# Altium project Udemy_ADAK.PrjPcb (part 3 of 3)

## Sheet Sensor Board.SchDoc
size A3; SheetNumber: 4; SheetTotal: 4
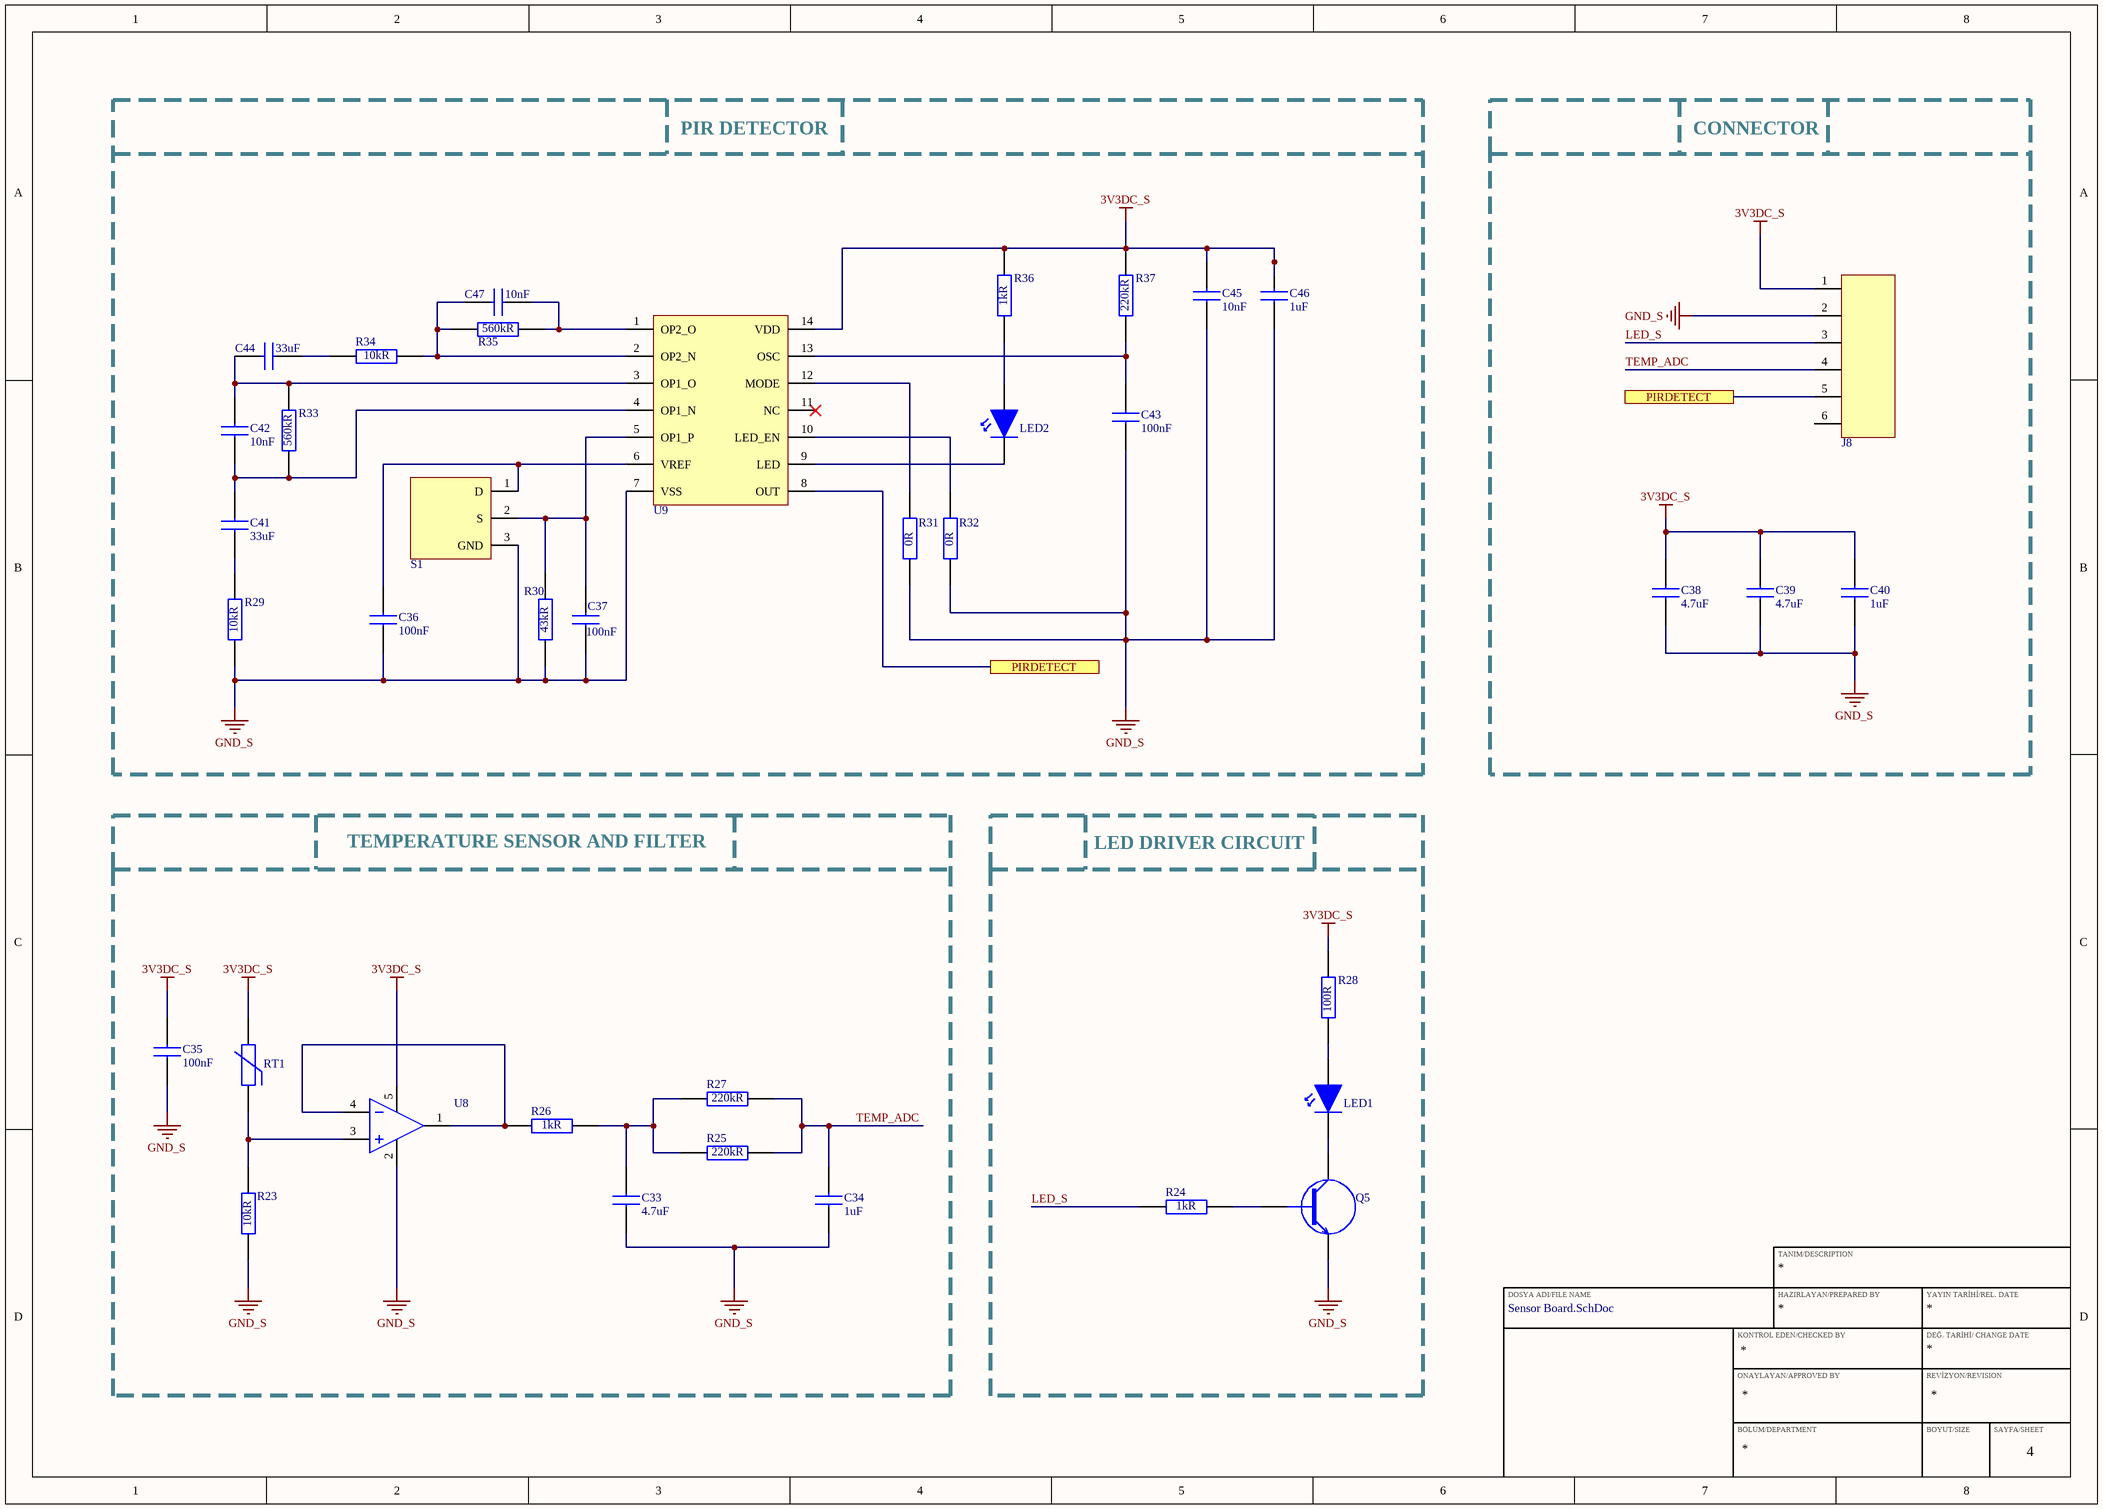
[diagram p3: Sensor Board.SchDoc]

### Parts
C33  Capacitance: 4.7uF  [CAP_0805]  (hidden comment: CL21A475KAQNNNE)
C34  Capacitance: 1uF  [CAP_0805]  (hidden comment: CL21B105KBFNNNE)
C35  Capacitance: 100nF  [CAP_0603]  (hidden comment: C0603C104K4RAC7867)
C36  Capacitance: 100nF  [CAP_0805]  (hidden comment: CL21B104KBCNNNC)
C37  Capacitance: 100nF  [CAP_0805]  (hidden comment: CL21B104KBCNNNC)
C38  Capacitance: 4.7uF  [CAP_0805]  (hidden comment: CL21A475KAQNNNE)
C39  Capacitance: 4.7uF  [CAP_0805]  (hidden comment: CL21A475KAQNNNE)
C40  Capacitance: 1uF  [CAP_0805]  (hidden comment: CL21B105KBFNNNE)
C41  Capacitance: 33uF  [CAP_0805]  (hidden comment: C2012X5R1A336M125AC)
C42  Capacitance: 10nF  [CAP_0603]  (hidden comment: 0603B103K160CT)
C43  Capacitance: 100nF  [CAP_0805]  (hidden comment: CL21B104KBCNNNC)
C44  Capacitance: 33uF  [CAP_0805]  (hidden comment: C2012X5R1A336M125AC)
C45  Capacitance: 10nF  [CAP_0603]  (hidden comment: 0603B103K160CT)
C46  Capacitance: 1uF  [CAP_0805]  (hidden comment: CL21B105KBFNNNE)
C47  Capacitance: 10nF  [CAP_0603]  (hidden comment: 0603B103K160CT)
J8  64800611622  [64800611622]  (value not drawn)
LED1  150080SS75000  [LED_RED_0805]  (value not drawn)
LED2  150080GS75000  [LED_GREEN_0805]  (value not drawn)
Q5  MMBT3904-7-F  [SOT-23F]  (value not drawn)
R23  Resistance: 10kR  [RES_0603]  (hidden comment: RC0603FR-0710KL)
R24  Resistance: 1kR  [RES_0603]  (hidden comment: RC0603FR-071KL)
R25  Resistance: 220kR  [RES_0603]  (hidden comment: RC0603JR-07220KL)
R26  Resistance: 1kR  [RES_0603]  (hidden comment: RC0603FR-071KL)
R27  Resistance: 220kR  [RES_0603]  (hidden comment: RC0603JR-07220KL)
R28  Resistance: 100R  [RES_0603]  (hidden comment: RC0603JR-13100RL)
R29  Resistance: 10kR  [RES_0603]  (hidden comment: RC0603FR-0710KL)
R30  Resistance: 43kR  [RES_0603]  (hidden comment: RC0603FR-0743KL)
R31  Resistance: 0R  [RES_0603]  (hidden comment: RC0603JR-070RL)
R32  Resistance: 0R  [RES_0603]  (hidden comment: RC0603JR-070RL)
R33  Resistance: 560kR  [RES_0603]  (hidden comment: RC0603JR-07560KL)
R34  Resistance: 10kR  [RES_0603]  (hidden comment: RC0603FR-0710KL)
R35  Resistance: 560kR  [RES_0603]  (hidden comment: RC0603JR-07560KL)
R36  Resistance: 1kR  [RES_0603]  (hidden comment: RC0603FR-071KL)
R37  Resistance: 220kR  [RES_0603]  (hidden comment: RC0603JR-07220KL)
RT1  TFPT1206L1002FM  [RES_1206]  (value not drawn)
S1  LHI 878/3902  [LHI 878]  (value not drawn)
U8  OPA314AIDBVT  [SOT23-5]  (value not drawn)
U9  NCS36000DRG  [SOIC-14]  (value not drawn)

### Blocks framed on the sheet
PIR DETECTOR: C36 C37 C41-C47 LED2 R29-R37 S1 U9
CONNECTOR: C38-C40 J8
TEMPERATURE SENSOR AND FILTER: C33-C35 R23 R25-R27 RT1 U8
LED DRIVER CIRCUIT: LED1 Q5 R24 R28

### Ports
PIRDETECT

### Nets
3V3DC_S: C35.2 C38.2 C39.2 C40.2 C45.2 C46.2 J8.1 R28.2 R36.2 R37.2 RT1.2 U8.5 U9.14(VDD)
GND_S: C33.1 C34.1 C35.1 C36.1 C37.2 C38.1 C39.1 C40.1 C43.2 C45.1 C46.1 J8.2 Q5.2(E) R23.1 R29.2 R30.1 R31.1 R32.1 S1.3(GND) U8.2 U9.7(VSS)
LED_S: J8.3 R24.1
TEMP_ADC: C34.2 J8.4 R25.2 R27.2
NetC33_2: C33.2 R25.1 R26.2 R27.1
NetC36_2: C36.2 S1.1(D) U9.6(VREF)
NetC37_1: C37.1 R30.2 S1.2(S) U9.5(OP1_P)
NetC41_1: C41.1 C42.2 R33.2 U9.4(OP1_N)
NetC41_2: C41.2 R29.1
NetC42_1: C42.1 C44.1 R33.1 U9.3(OP1_O)
NetC43_1: C43.1 R37.1 U9.13(OSC)
NetC44_2: C44.2 R34.1
NetC47_1: C47.1 R34.2 R35.1 U9.2(OP2_N)
NetC47_2: C47.2 R35.2 U9.1(OP2_O)
NetJ8_5: J8.5 U9.8(OUT) ; port PIRDETECT
NetLED1_1: LED1.1 Q5.3(C)
NetLED1_2: LED1.2 R28.1
NetLED2_1: LED2.1 U9.9(LED)
NetLED2_2: LED2.2 R36.1
NetQ5_1: Q5.1(B) R24.2
NetR23_2: R23.2 RT1.1 U8.3
NetR26_1: R26.1 U8.1 U8.4
NetR31_2: R31.2 U9.12(MODE)
NetR32_2: R32.2 U9.10(LED_EN)

Not connected (* = marked no-connect by the designer): J8 6; U9 11(NC)*

### Notes on the sheet
- TANIM/DESCRIPTION
- DOSYA ADI/FILE NAME
- HAZIRLAYAN/PREPARED BY
- YAYIN TARİHİ/REL. DATE
- KONTROL EDEN/CHECKED BY
- ONAYLAYAN/APPROVED BY
- DEĞ. TARİHİ/ CHANGE DATE
- REVİZYON/REVISION
- BÖLÜM/DEPARTMENT
- BOYUT/SIZE
- SAYFA/SHEET

### Library data of the parts
C33 C38 C39 = CAP CER 4.7uF 0805: |CAP CER 4.7UF %10 0805 SMD X5R; Manufacturer: Samsung; Designed by: ADAK; Tolerance: 10%; Voltage Rating: 25V; Supplier 1: Digi-Key; Manufacturer Part Number: CL21A475KAQNNNE; RoHS: Yes; Category: Ceramic Capacitors; Stock 1: 4312449; Pricing 1: 1=0,10000, 10=0,07300, 50=0,04140, 100=0,03440, 500=0,02408, 1000=0,01994 (USD); Mount: Surface Mount; Case/Package: 0805; Case Code (Metric): 2012; Case Code (Imperial): 0805; Min Operating Temperature: -55°C; Max Operating Temperature: 85°C; Package Quantity: 1; Packaging: Tape and Reel; Dielectric: X5R; Voltage Rating (DC): 25V; Series: CL; Construction: Flat; Length: 2mm; Width: 0.049inch; Height: 1.25mm; Thickness: 0.055inch; Depth: 1.25mm; Radiation Hardening: No; Lead Free: Lead Free; RoHS Compliant: Yes; ComponentLink1URL: https://datasheet.ciiva.com/25798/cl21a475kaqnnne-25798882.pdf?src-supplier=Digi-Key; ComponentLink1Description: https://datasheet.ciiva.com/25798/cl21a475kaqnnne-25798882.pdf?src-supplier=Digi-Key; Supplier Part Number 1: 1276-1244-1-ND
C34 C40 C46 = CAP CER 1uF 0805: |CAP CER 1UF %10 0805 SMD X7R; Manufacturer: Samsung; Tolerance: 10%; Voltage Rating: 50V; Designed by: ADAK; Supplier 1: Digi-Key; Manufacturer Part Number: CL21B105KBFNNNE; RoHS: Yes; Category: Ceramic Capacitors; Stock 1: 1344581; Pricing 1: 1=0,11000, 10=0,07900, 50=0,04500, 100=0,03730, 500=0,02616, 1000=0,02165 (USD); Mount: Surface Mount; Case/Package: 0805; Case Code (Metric): 2012; Case Code (Imperial): 0805; Min Operating Temperature: -55°C; Max Operating Temperature: 125°C; Packaging: Tape and Reel; Package Quantity: 1; Dielectric: X7R; Voltage: 50V; Series: CL; Construction: Flat; Length: 2mm; Width: 0.049inch; Height: 1.25mm; Thickness: 0.053inch; Depth: 1.25mm; Radiation Hardening: No; RoHS Compliant: Yes; ComponentLink1URL: https://datasheet.ciiva.com/25800/cl21b105kbfnnne-25800291.pdf?src-supplier=Digi-Key; ComponentLink1Description: https://datasheet.ciiva.com/25800/cl21b105kbfnnne-25800291.pdf?src-supplier=Digi-Key; Supplier Part Number 1: 1276-1029-6-ND
C35 = CAP CER 100nF 0603: |CAP CER 100nF (0.1UF) %10 0603 SMD; Manufacturer: KEMET; Manufacturer Part Number: C0603C104K4RACTU; Dielectric Material: Ceramic; Tolerance: 10%; Dielectric: X7R; Voltage Rating: 16V; Dissipation Factor: 3.5%; Designed by: ADAK; Supplier 1: Digi-Key; RoHS: Yes; Category: Ceramic Capacitors; Pricing 1: 1=0,10000, 10=0,07200, 50=0,03940, 100=0,03220, 500=0,02298, 1000=0,01805 (USD); Mount: Surface Mount,PCB; Case/Package: 0603; Number of Pins: 2; Case Code (Metric): 1608; Case Code (Imperial): 0603; Contact Plating: Tin,Matte; Weight: 7.1E-05oz; Min Operating Temperature: -55°C; Max Operating Temperature: 125°C; Package Quantity: 4000; Packaging: Tape and Reel; Voltage Rating (DC): 16V; Termination: SMD/SMT; Voltage: 16V; Series: SMD Comm X7R; Construction: Flat; Length: 1.6mm; Width: 0.8mm; Height: 0.8mm; Thickness: 0.034inch; Lead Pitch: 0.7mm; Depth: 0.8mm; Radiation Hardening: No; Reach SVHC Compliant: Yes; RoHS Compliant: Yes; ComponentLink1URL: https://datasheet.ciiva.com/22749/kem-c1002-x7r-smd-22749657.pdf?src-supplier=Element14; ComponentLink1Description: https://datasheet.ciiva.com/22749/kem-c1002-x7r-smd-22749657.pdf?src-supplier=Element14; ComponentLink2URL: https://datasheet.ciiva.com/14589/70095383-14589014.pdf?src-supplier=Allied+Electronics; ComponentLink2Description: https://datasheet.ciiva.com/14589/70095383-14589014.pdf?src-supplier=Allied+Electronics; ComponentLink3URL: https://datasheet.ciiva.com/5413/kem-c1002-x7r-smd-5413791.pdf?src-supplier=Mouser; ComponentLink3Description: https://datasheet.ciiva.com/5413/kem-c1002-x7r-smd-5413791.pdf?src-supplier=Mouser; ComponentLink4URL: https://datasheet.ciiva.com/18192/getdatasheetpartid-330584-18192695.pdf?src-supplier=Verical; ComponentLink4Description: https://datasheet.ciiva.com/18192/getdatasheetpartid-330584-18192695.pdf?src-supplier=Verical; Supplier Part Number 1: 399-C0603C104K4RAC7867DKR-ND
C36 C37 C43 = CAP CER 100nF 0805: |CAP CER 0.1UF (100nF) %10 0805 SMD X7R; Manufacturer: Samsung; Designed by: ADAK; Material: Ceramic; Tolerance: 10%; Voltage Rating: 50V; Supplier 1: Digi-Key; Manufacturer Part Number: CL21B104KBCNNNC; RoHS: Yes; Category: Ceramic Capacitors; Stock 1: 3413319; Pricing 1: 1=0,10000, 10=0,04400, 50=0,02400, 100=0,01960, 500=0,01404, 1000=0,01103 (USD); Mount: Surface Mount; Case/Package: 0805; Case Code (Metric): 2012; Case Code (Imperial): 0805; Contact Plating: Tin; Min Operating Temperature: -55°C; Max Operating Temperature: 125°C; Dielectric: X7R; Packaging: Tape and Reel; Voltage: 50V; Voltage Rating (DC): 50V; Series: CL; Construction: Flat; Length: 2mm; Width: 0.049inch; Height: 0.85mm; Depth: 1.25mm; Thickness: 0.037inch; Radiation Hardening: No; Lead Free: Lead Free; RoHS Compliant: Yes; ComponentLink1URL: https://datasheet.ciiva.com/25710/cl21b104kbcnnnc-25710182.pdf?src-supplier=Digi-Key; ComponentLink1Description: https://datasheet.ciiva.com/25710/cl21b104kbcnnnc-25710182.pdf?src-supplier=Digi-Key; ComponentLink2URL: https://datasheet.ciiva.com/29199/454152-da-01-en-vs-kondensator-0805-29199814.pdf?src-supplier=Conrad; ComponentLink2Description: https://datasheet.ciiva.com/29199/454152-da-01-en-vs-kondensator-0805-29199814.pdf?src-supplier=Conrad; Supplier Part Number 1: 1276-1003-1-ND
C41 C44 = CAP CER 33uF 0805: |CAP CER 33UF %20 0805 X5R 10V; Manufacturer: TDK; Dielectric Material: Ceramic; Tolerance: 20%; Designed by: ADAK; Supplier 1: Digi-Key; Manufacturer Part Number: C2012X5R1A336M125AC; RoHS: Yes; Category: Ceramic Capacitors; Stock 1: 479672; Pricing 1: 1=0,86000, 10=0,65600, 50=0,54540, 100=0,46960, 500=0,36360, 1000=0,31310 (USD); Mount: Surface Mount; Case/Package: 0805; Case Code (Metric): 2012; Case Code (Imperial): 0805; Weight: 0.000194oz; Min Operating Temperature: -55°C; Max Operating Temperature: 85°C; Voltage Rating: 10V; Packaging: Tape and Reel; Termination: SMD/SMT; Package Quantity: 1; Voltage Rating (DC): 10V; Dielectric: X5R; Resistor Type: Ceramic; Series: C; Length: 2mm; Width: 0.049inch; Height: 1.25mm; Thickness: 0.057inch; Depth: 1.25mm; Reach SVHC Compliant: Yes; Lead Free: Lead Free; RoHS Compliant: Yes; ComponentLink1URL: https://datasheet.ciiva.com/24216/c2012x5r1a336m125ac-264804-24216541.pdf?src-supplier=Mouser; ComponentLink1Description: https://datasheet.ciiva.com/24216/c2012x5r1a336m125ac-264804-24216541.pdf?src-supplier=Mouser; ComponentLink2URL: https://datasheet.ciiva.com/6259/tdkmlcccaprange-6259263.pdf?src-supplier=Digi-Key; ComponentLink2Description: https://datasheet.ciiva.com/6259/tdkmlcccaprange-6259263.pdf?src-supplier=Digi-Key; Supplier Part Number 1: 445-8238-1-ND
C42 C45 C47 = CAP CER 10nF 0603: |CAP CER 10nF %10 0603 SMD X7R; Manufacturer: Walsin Technologies; Tolerance: 10%; Voltage Rating: 16V; Designed by: ADAK; Supplier 1: Digi-Key; Manufacturer Part Number: 0603B103K160CT; RoHS: Yes; Category: Ceramic Capacitors; Stock 1: 148568; Pricing 1: 1=0,10000, 10=0,03300, 50=0,01820, 100=0,01480, 500=0,01060, 1000=0,00833 (USD); Case/Package: 0603; Case Code (Metric): 1608; Case Code (Imperial): 0603; Min Operating Temperature: -55°C; Max Operating Temperature: 125°C; Packaging: Tape and Reel; Dielectric: X7R; Voltage Rating (DC): 16V; Length: 1.6mm; Depth: 0.8mm; RoHS Compliant: Yes; ComponentLink1URL: http://www.farnell.com/datasheets/1958513.pdf?src-supplier=Farnell; ComponentLink1Description: http://www.farnell.com/datasheets/1958513.pdf?src-supplier=Farnell; ComponentLink2URL: http://www.farnell.com/datasheets/1958513.pdf?src-supplier=Element14; ComponentLink2Description: http://www.farnell.com/datasheets/1958513.pdf?src-supplier=Element14; ComponentLink3URL: http://www.passivecomponent.com/wp-content/uploads/2018/10/MLCC.pdf?src-supplier=Digi-Key; ComponentLink3Description: http://www.passivecomponent.com/wp-content/uploads/2018/10/MLCC.pdf?src-supplier=Digi-Key; Supplier Part Number 1: 1292-1384-1-ND
J8 = 64800611622_CONN_6P: |Connector (1.50mm) 6 Pin Header Through Hole; Manufacturer: Wurth Electronics; Designed by: ADAK; Supplier 1: Digi-Key; Manufacturer Part Number: 64800611622; RoHS: No; Stock 1: 979; Pricing 1: 1=0,42000, 50=0,40600, 100=0,38400, 250=0,36100, 500=0,33900 (USD); Supplier Part Number 1: 732-64800611622-ND
LED1 = LED RED 0805: |LED RED CLEAR 0805 SMD; Manufacturer: Wurth Electronics; Lens Color: Colorless; Luminous Intensity: 60mcd; Forward Current: 30mA; Forward Voltage: 1.9V; Viewing Angle: 140°; Wavelength: 630nm; Lens Style: Clear,Flat,Rectangular; Test Current: 20mA; Lens Size: 1.25mm; Designed by: ADAK; Supplier 1: Digi-Key; Manufacturer Part Number: 150080SS75000; RoHS: Yes; Category: LEDs; Stock 1: 36817; Pricing 1: 1=0,19000, 50=0,17600, 100=0,15100, 500=0,13100 (USD); Mount: Surface Mount; Case/Package: 0805; Color: Red; Case Code (Metric): 2012; Case Code (Imperial): 0805; Min Operating Temperature: -40°C; Max Operating Temperature: 85°C; Package Quantity: 1; Packaging: Cut Tape; Dominant Wavelength: 630nm; Series: WL-SMCW; Lens Transparency: Clear; Length: 2mm; Width: 1.25mm; Height: 0.8mm; RoHS Compliant: Yes; ComponentLink1URL: https://datasheet.ciiva.com/22656/150080ss75000-22656963.pdf?src-supplier=Element14; ComponentLink1Description: https://datasheet.ciiva.com/22656/150080ss75000-22656963.pdf?src-supplier=Element14; ComponentLink2URL: https://datasheet.ciiva.com/29279/759436-da-01-en-chipled-0805-w-kl-s-rot-150080ss75000-29279211.pdf?src-supplier=Conrad; ComponentLink2Description: https://datasheet.ciiva.com/29279/759436-da-01-en-chipled-0805-w-kl-s-rot-150080ss75000-29279211.pdf?src-supplier=Conrad; ComponentLink3URL: https://datasheet.ciiva.com/29563/150080ss75000-29563014.pdf?src-supplier=Digi-Key; ComponentLink3Description: https://datasheet.ciiva.com/29563/150080ss75000-29563014.pdf?src-supplier=Digi-Key; ComponentLink4URL: https://datasheet.ciiva.com/29563/150080ss75000-29563013.pdf?src-supplier=Digi-Key; ComponentLink4Description: https://datasheet.ciiva.com/29563/150080ss75000-29563013.pdf?src-supplier=Digi-Key; ComponentLink5URL: https://datasheet.ciiva.com/29563/150080ss75000-29563015.pdf?src-supplier=Digi-Key; ComponentLink5Description: https://datasheet.ciiva.com/29563/150080ss75000-29563015.pdf?src-supplier=Digi-Key; Supplier Part Number 1: 732-4985-1-ND
LED2 = LED GREEN 0805: |LED GREEN CLEAR 0805 SMD; Manufacturer: Wurth Electronics; Lens Color: Colorless; Viewing Angle: 140°; Lens Style: Clear,Flat,Rectangular; Luminous Intensity: 450mcd; Forward Voltage: 3.2V; Wavelength: 520nm; Forward Current: 30mA; Test Current: 20mA; Lens Size: 1.25mm; Designed by: ADAK; Supplier 1: Digi-Key; Manufacturer Part Number: 150080GS75000; RoHS: Yes; Category: LEDs; Stock 1: 91506; Pricing 1: 1=0,19000, 50=0,17600, 100=0,15100, 500=0,13100 (USD); Mount: Surface Mount; Case/Package: 0805; Color: Green; Case Code (Metric): 2012; Case Code (Imperial): 0805; Min Operating Temperature: -40°C; Max Operating Temperature: 85°C; Package Quantity: 1; Packaging: Cut Tape; Dominant Wavelength: 520nm; Series: WL-SMCW; Lens Transparency: Clear; Length: 2mm; Width: 1.25mm; Height: 0.8mm; RoHS Compliant: Yes; ComponentLink1URL: https://datasheet.ciiva.com/29563/150080gs75000-29563008.pdf?src-supplier=Digi-Key; ComponentLink1Description: https://datasheet.ciiva.com/29563/150080gs75000-29563008.pdf?src-supplier=Digi-Key; ComponentLink2URL: https://datasheet.ciiva.com/29279/759434-da-01-en-chipled-0805-w-kl-gruen-150080gs75000-29279039.pdf?src-supplier=Conrad; ComponentLink2Description: https://datasheet.ciiva.com/29279/759434-da-01-en-chipled-0805-w-kl-gruen-150080gs75000-29279039.pdf?src-supplier=Conrad; Supplier Part Number 1: 732-4983-1-ND
Q5 = MMBT3904-7-F: |Bipolar (BJT) Transistor NPN 40 V 200 mA 300MHz 300 mW Surface Mount SOT-23-3; Manufacturer: Diodes Zetex; Max Power Dissipation: 300mW; Collector Emitter Voltage (VCEO): 40V; Max Collector Current: 200mA; Collector Base Voltage (VCBO): 60V; Power Dissipation: 350mW; hFE Min: 100; Number of Elements: 1; Emitter Base Voltage (VEBO): 6V; Collector Emitter Saturation Voltage: 300mV; Element Configuration: Single; Designed by: ADAK; Supplier 1: Digi-Key; Manufacturer Part Number: MMBT3904-7-F; RoHS: Yes; Category: BJTs; Stock 1: 7229342; Pricing 1: 1=0,13000, 10=0,11700, 100=0,06370, 500=0,03918, 1000=0,02671 (USD); Mount: Surface Mount; Case/Package: SOT-23; Number of Pins: 3; Weight: 0.000282oz; Contact Plating: Tin,Matte; Min Operating Temperature: -55°C; Max Operating Temperature: 150°C; Polarity: NPN; Packaging: Tape and Reel; Frequency: 300MHz; Package Quantity: 3000; Transition Frequency: 300MHz; Collector Emitter Breakdown Voltage: 40V; Max Breakdown Voltage: 40V; Continuous Collector Current: 200mA; Max Frequency: 300MHz; Gain Bandwidth Product: 300MHz; Voltage Rating (DC): 40V; Series: Automotive, AEC-Q101; Collector-emitter Voltage-Max: 300mV; Length: 3.05mm; Width: 1.4mm; Height: 1mm; Radiation Hardening: No; Reach SVHC Compliant: Yes; Lead Free: Lead Free; RoHS Compliant: Yes; ComponentLink1URL: https://datasheet.ciiva.com/11201/ds30036-11201778.pdf?src-supplier=Avnet; ComponentLink1Description: https://datasheet.ciiva.com/11201/ds30036-11201778.pdf?src-supplier=Avnet; ComponentLink2URL: https://datasheet.ciiva.com/15138/getdatasheetpartid-53265-15138780.pdf?src-supplier=Verical; ComponentLink2Description: https://datasheet.ciiva.com/15138/getdatasheetpartid-53265-15138780.pdf?src-supplier=Verical; ComponentLink3URL: https://datasheet.ciiva.com/22711/1915516-22711750.pdf?src-supplier=Element14; ComponentLink3Description: https://datasheet.ciiva.com/22711/1915516-22711750.pdf?src-supplier=Element14; ComponentLink4URL: https://datasheet.ciiva.com/11198/ds30036-11198999.pdf?src-supplier=Avnet; ComponentLink4Description: https://datasheet.ciiva.com/11198/ds30036-11198999.pdf?src-supplier=Avnet; ComponentLink5URL: https://datasheet.ciiva.com/6361/ds30036-6361256.pdf?src-supplier=Digi-Key; ComponentLink5Description: https://datasheet.ciiva.com/6361/ds30036-6361256.pdf?src-supplier=Digi-Key; ComponentLink6URL: https://datasheet.ciiva.com/6361/ds30036-6361254.pdf?src-supplier=Digi-Key; ComponentLink6Description: https://datasheet.ciiva.com/6361/ds30036-6361254.pdf?src-supplier=Digi-Key; Supplier Part Number 1: MMBT3904-FDICT-ND
R23 R29 R34 = RES 10K OHM 0603: |RES 10KΩ 1% 0603 SMD; Manufacturer: Yageo; Temperature Coefficient: 100ppm/°C; Voltage Rating (DC): 50V; Power Rating: 100mW; Voltage Rating: 75V; Designed by: ADAK; Supplier 1: Digi-Key; Manufacturer Part Number: RC0603FR-0710KL; RoHS: Yes; Category: Chip SMD Resistors; Stock 1: 37352246; Pricing 1: 1=0,10000, 10=0,01900, 100=0,00770, 1000=0,00345, 2500=0,00300 (USD); Case/Package: 0603; Number of Pins: 2; Case Code (Imperial): 0603; Case Code (Metric): 1608; Weight: 7.1E-05oz; Size Code: 0603; Min Operating Temperature: -55°C; Max Operating Temperature: 155°C; Tolerance: 1%; Resistor Type: Thick Film; Packaging: Tape and Reel; Termination: SMD/SMT; Features: Moisture Resistant; Series: RC; Max Power Dissipation: 100mW; Number of Terminations: 2; Resistance Tolerance: 1%; Construction: Rectangular; Length: 1.6mm; Width: 0.8mm; Height: 0.45mm; Depth: 0.8mm; Lead Pitch: 0.3mm; Reach SVHC Compliant: Yes; Lead Free: Lead Free; Military Standard: Not; RoHS Compliant: Yes; ComponentLink1URL: https://datasheet.ciiva.com/7660/38590-7660789.pdf?src-supplier=Element14; ComponentLink1Description: https://datasheet.ciiva.com/7660/38590-7660789.pdf?src-supplier=Element14; ComponentLink2URL: https://datasheet.ciiva.com/7983/443971-7983596.pdf?src-supplier=Element14; ComponentLink2Description: https://datasheet.ciiva.com/7983/443971-7983596.pdf?src-supplier=Element14; ComponentLink3URL: https://datasheet.ciiva.com/22747/443971-22747519.pdf?src-supplier=Element14; ComponentLink3Description: https://datasheet.ciiva.com/22747/443971-22747519.pdf?src-supplier=Element14; ComponentLink4URL: https://datasheet.ciiva.com/46440/1868787-46440891.pdf?src-supplier=Element14; ComponentLink4Description: https://datasheet.ciiva.com/46440/1868787-46440891.pdf?src-supplier=Element14; ComponentLink5URL: https://datasheet.ciiva.com/7746/1738695-7746239.pdf?src-supplier=Element14; ComponentLink5Description: https://datasheet.ciiva.com/7746/1738695-7746239.pdf?src-supplier=Element14; ComponentLink6URL: https://datasheet.ciiva.com/15189/getdatasheetpartid-409289-15189591.pdf?src-supplier=Verical; ComponentLink6Description: https://datasheet.ciiva.com/15189/getdatasheetpartid-409289-15189591.pdf?src-supplier=Verical; Supplier Part Number 1: 311-10.0KHRCT-ND
R24 R26 R36 = RES 1K OHM 0603: |RES 1KΩ 1% 0603 SMD; Manufacturer: Yageo; Temperature Coefficient: 100ppm/°C; Power Rating: 100mW; Voltage Rating: 50V; Designed by: ADAK; Supplier 1: Digi-Key; Manufacturer Part Number: RC0603FR-071KL; RoHS: Yes; Category: Chip SMD Resistors; Stock 1: 27865761; Pricing 1: 1=0,10000, 10=0,01900, 100=0,00770, 1000=0,00345, 2500=0,00300 (USD); Case/Package: 0603; Contact Plating: Tin,Matte; Case Code (Imperial): 0603; Case Code (Metric): 1608; Size Code: 0603; Min Operating Temperature: -55°C; Max Operating Temperature: 155°C; Tolerance: 1%; Resistor Type: Thick Film; Packaging: Tape and Reel; Termination: SMD/SMT; Features: Moisture Resistant; Series: RC; Max Power Dissipation: 100mW; Number of Terminations: 2; Technology: THICK FILM; Resistance Tolerance: 1%; Construction: Rectangular; Length: 1.6mm; Height: 0.45mm; Depth: 0.8mm; Radiation Hardening: No; Reach SVHC Compliant: Yes; Lead Free: Lead Free; Military Standard: Not; RoHS Compliant: Yes; Supplier Part Number 1: 311-1.00KHRCT-ND
R25 R27 R37 = RES 220K OHM 0603: |RES 220KΩ 5% 0603 SMD; Manufacturer: Yageo; Designed by: ADAK; Temperature Coefficient: 100ppm/°C; Voltage Rating (DC): 50V; Power Rating: 100mW; Supplier 1: Digi-Key; Manufacturer Part Number: RC0603JR-07220KL; RoHS: Yes; Category: Chip SMD Resistors; Stock 1: 1184721; Pricing 1: 1=0,10000, 10=0,01600, 100=0,00630, 1000=0,00284, 2500=0,00246 (USD); Case/Package: 0603; Number of Pins: 2; Case Code (Imperial): 0603; Case Code (Metric): 1608; Size Code: 0603; Min Operating Temperature: -55°C; Max Operating Temperature: 155°C; Resistor Type: Thick Film; Tolerance: 5%; Packaging: Tape and Reel; Voltage Rating: 50V; Package Quantity: 1; Termination: SMD/SMT; Number of Terminations: 2; Max Power Dissipation: 100mW; Features: Moisture Resistant; Series: RC; Construction: Rectangular; Resistance Tolerance: 5%; Length: 0.063inch; Width: 0.031inch; Height: 0.022inch; Depth: 0.8mm; Reach SVHC Compliant: Yes; Lead Free: Lead Free; RoHS Compliant: Yes; Military Standard: Not; ComponentLink1URL: https://datasheet.ciiva.com/2452/pyu-r-int-thick-7-2452924.pdf?src-supplier=Digi-Key; ComponentLink1Description: https://datasheet.ciiva.com/2452/pyu-r-int-thick-7-2452924.pdf?src-supplier=Digi-Key; ComponentLink2URL: https://datasheet.ciiva.com/2452/pyu-r-int-thick-7-2452925.pdf?src-supplier=Digi-Key; ComponentLink2Description: https://datasheet.ciiva.com/2452/pyu-r-int-thick-7-2452925.pdf?src-supplier=Digi-Key; ComponentLink3URL: https://datasheet.ciiva.com/2452/pyu-r-int-thick-7-2452923.pdf?src-supplier=Digi-Key; ComponentLink3Description: https://datasheet.ciiva.com/2452/pyu-r-int-thick-7-2452923.pdf?src-supplier=Digi-Key; Supplier Part Number 1: 311-220KGRCT-ND
R28 = RES 100 OHM 0603: |RES 100Ω 5% 0603 SMD; Manufacturer: Yageo; Power Rating: 100mW; Voltage Rating: 50V; Temperature Coefficient: 100ppm/°C; Designed by: ADAK; Supplier 1: Digi-Key; Manufacturer Part Number: RC0603JR-13100RL; RoHS: Yes; Category: Chip SMD Resistors; Stock 1: 95272; Pricing 1: 1=0,10000, 10=0,01600, 100=0,00630, 1000=0,00284, 2500=0,00246, 5000=0,00203 (USD); Case/Package: 0603; Number of Pins: 2; Case Code (Imperial): 0603; Case Code (Metric): 1608; Min Operating Temperature: -55°C; Max Operating Temperature: 155°C; Tolerance: 5%; Packaging: Tape and Reel; Resistor Type: Thick Film; Termination: SMD/SMT; Voltage Rating (DC): 50V; Series: RC; Construction: Rectangular; Resistance Tolerance: 5%; Length: 1.6mm; Width: 0.8mm; Height: 0.45mm; Depth: 0.8mm; Reach SVHC Compliant: Yes; Military Standard: Not; Lead Free: Lead Free; RoHS Compliant: Yes; ComponentLink1URL: https://datasheet.ciiva.com/7983/443971-7983750.pdf?src-supplier=Element14; ComponentLink1Description: https://datasheet.ciiva.com/7983/443971-7983750.pdf?src-supplier=Element14; ComponentLink2URL: https://datasheet.ciiva.com/12558/rc0603-272842-12558903.pdf?src-supplier=Mouser; ComponentLink2Description: https://datasheet.ciiva.com/12558/rc0603-272842-12558903.pdf?src-supplier=Mouser; Supplier Part Number 1: 13-RC0603JR-13100RLCT-ND
R30 = RES 43K OHM 0603: |RES 43KΩ 1% 0603 SMD; Manufacturer: Yageo; Designed by: ADAK; Power Rating: 100mW; Voltage Rating: 50V; Temperature Coefficient: 100ppm/°C; Working Voltage: 75V; ComponentLink1URL: http://www.farnell.com/datasheets/1868787.pdf?src-supplier=Farnell; ComponentLink1Description: http://www.farnell.com/datasheets/1868787.pdf?src-supplier=Farnell; ComponentLink2URL: http://www.mouser.com/ds/2/447/RC0603-272842.pdf?src-supplier=Mouser; ComponentLink2Description: http://www.mouser.com/ds/2/447/RC0603-272842.pdf?src-supplier=Mouser; ComponentLink3URL: http://www.farnell.com/datasheets/1868787.pdf?src-supplier=Element14; ComponentLink3Description: http://www.farnell.com/datasheets/1868787.pdf?src-supplier=Element14; ComponentLink4URL: http://www.yageo.com/documents/recent/PYu-RC_Group_51_RoHS_L_9.pdf?src-supplier=Digi-Key; ComponentLink4Description: http://www.yageo.com/documents/recent/PYu-RC_Group_51_RoHS_L_9.pdf?src-supplier=Digi-Key; ComponentLink5URL: http://www.yageo.com.tw/exep/pages/download/literatures/PYu-R_INT-thick_7.pdf?src-supplier=Digi-Key; ComponentLink5Description: http://www.yageo.com.tw/exep/pages/download/literatures/PYu-R_INT-thick_7.pdf?src-supplier=Digi-Key; ComponentLink6URL: http://www.yageo.com/documents/recent/PYu-RC0603_51_RoHS_L_4.pdf?src-supplier=Avnet; ComponentLink6Description: http://www.yageo.com/documents/recent/PYu-RC0603_51_RoHS_L_4.pdf?src-supplier=Avnet; ComponentLink7URL: http://www.yageo.com/documents/recent/PYu-RC0603_51_RoHS_L_7.pdf?src-supplier=Future+Electronics; ComponentLink7Description: http://www.yageo.com/documents/recent/PYu-RC0603_51_RoHS_L_7.pdf?src-supplier=Future+Electronics; ComponentLink8URL: http://www.yageo.com/documents/recent/PYu-RC_Group_51_RoHS_L_10.pdf?src-supplier=Digi-Key; ComponentLink8Description: http://www.yageo.com/documents/recent/PYu-RC_Group_51_RoHS_L_10.pdf?src-supplier=Digi-Key; Supplier 1: Digi-Key; Manufacturer Part Number: RC0603FR-0743KL; RoHS: Yes; Category: Chip SMD Resistors; Stock 1: 534652; Pricing 1: 1=0,10000, 10=0,02000, 100=0,00820, 1000=0,00367, 2500=0,00318 (USD); Case/Package: 0603; Case Code (Metric): 1608; Case Code (Imperial): 0603; Min Operating Temperature: -55°C; Max Operating Temperature: 155°C; Tolerance: 1%; Packaging: Tape and Reel; Resistor Type: Thick Film; Number of Terminations: 2; Termination: SMD/SMT; Max Power Dissipation: 100mW; Voltage Rating (DC): 50V; Features: Moisture Resistant; Series: RC; Construction: Rectangular; Package Quantity: 1; Technology: METAL OXIDE FILM; Length: 1.6mm; Width: 0.031inch; Height: 0.022inch; Depth: 0.8mm; Military Standard: Not; Lead Free: Lead Free; RoHS Compliant: Yes; ComponentLink9URL: https://datasheet.ciiva.com/2454/pyu-r-int-thick-7-2454880.pdf?src-supplier=Digi-Key; ComponentLink9Description: https://datasheet.ciiva.com/2454/pyu-r-int-thick-7-2454880.pdf?src-supplier=Digi-Key; ComponentLink10URL: https://datasheet.ciiva.com/2454/pyu-r-int-thick-7-2454881.pdf?src-supplier=Digi-Key; ComponentLink10Description: https://datasheet.ciiva.com/2454/pyu-r-int-thick-7-2454881.pdf?src-supplier=Digi-Key; ComponentLink11URL: https://datasheet.ciiva.com/2454/pyu-r-int-thick-7-2454879.pdf?src-supplier=Digi-Key; ComponentLink11Description: https://datasheet.ciiva.com/2454/pyu-r-int-thick-7-2454879.pdf?src-supplier=Digi-Key; ComponentLink12URL: https://datasheet.ciiva.com/12558/rc0603-272842-12558507.pdf?src-supplier=Mouser; ComponentLink12Description: https://datasheet.ciiva.com/12558/rc0603-272842-12558507.pdf?src-supplier=Mouser; Supplier Part Number 1: 311-43.0KHRDKR-ND
R31 R32 = RES 0 OHM 0603: |RES 0Ω 0603 SMD JUMPER; Manufacturer: Yageo; Tolerance: 1%; Power Rating: 100mW; Voltage Rating (DC): 50V; Temperature Coefficient: 200ppm/°C; Resistance Tolerance: 5%; Designed by: ADAK; Supplier 1: Digi-Key; Manufacturer Part Number: RC0603JR-070RL; RoHS: Yes; Category: Chip SMD Resistors; Stock 1: 12975277; Pricing 1: 1=0,10000, 10=0,01600, 25=0,01120, 50=0,00860, 100=0,00630, 250=0,00480, 500=0,00386, 1000=0,00284 (USD); Case/Package: 0603; Number of Pins: 2; Contact Plating: Tin,Matte; Case Code (Imperial): 0603; Case Code (Metric): 1608; Size Code: 0603; Min Operating Temperature: -55°C; Max Operating Temperature: 155°C; Resistor Type: Thick Film; Packaging: Tape and Reel; Termination: SMD/SMT; Series: RC; Technology: THICK FILM; Package Quantity: 5000; Voltage Rating: 50V; Features: Moisture Resistant; Max Power Dissipation: 100mW; Number of Terminations: 2; Construction: Rectangular; Length: 1.6mm; Width: 0.8mm; Height: 0.45mm; Depth: 0.8mm; Radiation Hardening: No; Lead Free: Lead Free; RoHS Compliant: Yes; Military Standard: Not; Supplier Part Number 1: 311-0.0GRCT-ND
R33 R35 = RES 560K OHM 0603: |RES 560KΩ 5% 0603 SMD; Manufacturer: Yageo; Power Rating: 100mW; Voltage Rating: 75V; Voltage Rating (DC): 50V; Temperature Coefficient: 100ppm/°C; Designed by: ADAK; Supplier 1: Digi-Key; Manufacturer Part Number: RC0603JR-07560KL; RoHS: Yes; Category: Chip SMD Resistors; Stock 1: 526882; Pricing 1: 1=0,10000, 10=0,01600, 100=0,00630, 1000=0,00284, 2500=0,00246 (USD); Case/Package: 0603; Number of Pins: 2; Case Code (Metric): 1608; Case Code (Imperial): 0603; Weight: 7.1E-05oz; Min Operating Temperature: -55°C; Max Operating Temperature: 155°C; Package Quantity: 1; Tolerance: 5%; Packaging: Tape and Reel; Resistor Type: Thick Film; Number of Terminations: 2; Termination: SMD/SMT; Max Power Dissipation: 100mW; Working Voltage: 75V; Features: Moisture Resistant; Series: RC; Resistance Tolerance: 5%; Construction: Rectangular; Technology: THICK FILM; Length: 0.063inch; Width: 0.8mm; Height: 0.022inch; Depth: 0.8mm; Military Standard: Not; Lead Free: Lead Free; RoHS Compliant: Yes; ComponentLink1URL: https://datasheet.ciiva.com/2453/pyu-r-int-thick-7-2453056.pdf?src-supplier=Digi-Key; ComponentLink1Description: https://datasheet.ciiva.com/2453/pyu-r-int-thick-7-2453056.pdf?src-supplier=Digi-Key; ComponentLink2URL: https://datasheet.ciiva.com/2453/pyu-r-int-thick-7-2453057.pdf?src-supplier=Digi-Key; ComponentLink2Description: https://datasheet.ciiva.com/2453/pyu-r-int-thick-7-2453057.pdf?src-supplier=Digi-Key; ComponentLink3URL: https://datasheet.ciiva.com/2453/pyu-r-int-thick-7-2453055.pdf?src-supplier=Digi-Key; ComponentLink3Description: https://datasheet.ciiva.com/2453/pyu-r-int-thick-7-2453055.pdf?src-supplier=Digi-Key; Supplier Part Number 1: 311-560KGRCT-ND
RT1 = TFPT1206L1002FM: |Thermistor PTC 10K Ohm 1%  1206 Surface Mount; Manufacturer: Vishay Dale; Resistance: 10kR; Power Rating: 125mW; Voltage: 40V; Designed by: ADAK; Supplier 1: Farnell; Manufacturer Part Number: TFPT1206L1002FM; RoHS: Yes; Category: Thermistors; Stock 1: 2652; Pricing 1: 10=0,80600, 100=0,73000, 500=0,61500, 1000=0,54800, 2500=0,51400, 5000=0,48000, 25000=0,47000, 50000=0,46100 (EUR); Mount: Surface Mount; Case/Package: 1206; Number of Pins: 2; Min Operating Temperature: -55°C; Max Operating Temperature: 125°C; Packaging: Tape and Reel; Package Quantity: 5000; Tolerance: 1%; Max Power Dissipation: 125mW; Termination: SMD/SMT; Series: TFPT; Resistance Tolerance: 1%; Length: 3.2mm; Width: 1.6mm; Height: 0.55mm; Depth: 1.6mm; Lead Free: Lead Free; RoHS Compliant: Yes; ComponentLink1URL: https://datasheet.ciiva.com/2852/tfpt-2852076.pdf?src-supplier=Digi-Key; ComponentLink1Description: https://datasheet.ciiva.com/2852/tfpt-2852076.pdf?src-supplier=Digi-Key; Supplier Part Number 1: 3518748
S1 = LHI 878/3902: |Sensor PIR (Passive Infrared) TO-205AA, TO-5-3 Metal Can; Manufacturer: Excelitas; Designed by: ADAK; Voltage-Supply: 2V ~ 12V; Output Type: Analog; Supplier 1: Digi-Key; Manufacturer Part Number: LHI 878/3902; RoHS: No; Category: Optical Motion Sensors; Stock 1: 9,811; Pricing 1: 1=8,09000, 5=7,10000, 10=6,39000, 25=5,68000, 50=5,25400, 100=4,54400, 500=4,26000, 1000=3,97600 (USD); Supplier Part Number 1: LHI 878/3902; ComponentLink1Description: Datasheet; ComponentLink1URL: https://www.excelitas.com/product/pyd-1388-pyd-1398-dual-element-pyros; Case/Package: LHI 878
U8 = OPA314: |Operational Amplifiers - Op Amps 3MHz,RRIO,1.8V CMOS Op Amp; Manufacturer: Texas Instruments; Max Supply Voltage: 5.5V; Min Dual Supply Voltage: 900mV; Max Dual Supply Voltage: 2.75V; Voltage Gain: 128dB; Common Mode Rejection Ratio: 75dB; Output Current: 20mA; Nominal Supply Current: 150uA; Number of Channels: 1; Slew Rate: 1.5V/µs; Max I/O Voltage: 2.5mV; Input Bias Current: 10pA; Power Supply Rejection Ratio (PSRR): 78dB; Max Frequency: 1kHz; Amplifier Type: GENERAL PURPOSE; Designed by: ADAK; Supplier 1: Mouser; Manufacturer Part Number: OPA314AIDBVT; RoHS: Yes; Category: Amplifiers - Op Amps, Buffer, Instrumentation; Stock 1: 18392; Pricing 1: 1=1,45000, 10=1,30000, 50=1,23000, 100=1,01000, 1000=0,83700, 10000=0,83700 (USD); Case/Package: SOT-23; Number of Pins: 5; Min Operating Temperature: -40°C; Max Operating Temperature: 125°C; Min Supply Voltage: 1.8V; Gain Bandwidth Product: 3MHz; Package Quantity: 250; Packaging: Tape and Reel; Bandwidth: 3MHz; Unity Gain Bandwidth Product: 3MHz; Nominal Gain Bandwidth Product: 3MHz; Number of Circuits: 1; Input Offset Voltage (Vos): 2.5mV; Operating Supply Current: 150uA; Output Current per Channel: 20mA; Number of Amplifiers: 1; Number of Elements: 1; Series: -; Supply Current: 150uA; Technology: CMOS; Length: 3.05mm; Width: 1.75mm; Height: 1.3mm; Radiation Hardening: No; Reach SVHC Compliant: Yes; Lead Free: Lead Free; RoHS Compliant: Yes; ComponentLink1URL: https://datasheet.ciiva.com/6629/opa314-6629296.pdf?src-supplier=Digi-Key; ComponentLink1Description: https://datasheet.ciiva.com/6629/opa314-6629296.pdf?src-supplier=Digi-Key; ComponentLink2URL: https://datasheet.ciiva.com/22667/1716477-22667503.pdf?src-supplier=Element14; ComponentLink2Description: https://datasheet.ciiva.com/22667/1716477-22667503.pdf?src-supplier=Element14; ComponentLink3URL: https://datasheet.ciiva.com/23854/1777778-23854689.pdf?src-supplier=Newark; ComponentLink3Description: https://datasheet.ciiva.com/23854/1777778-23854689.pdf?src-supplier=Newark; ComponentLink4URL: https://datasheet.ciiva.com/46396/1882109-46396086.pdf?src-supplier=Element14; ComponentLink4Description: https://datasheet.ciiva.com/46396/1882109-46396086.pdf?src-supplier=Element14; ComponentLink5URL: https://datasheet.ciiva.com/14378/opa2314-14378887.pdf?src-supplier=Avnet; ComponentLink5Description: https://datasheet.ciiva.com/14378/opa2314-14378887.pdf?src-supplier=Avnet; ComponentLink6URL: https://datasheet.ciiva.com/14456/opa2314-14456283.pdf?src-supplier=Avnet; ComponentLink6Description: https://datasheet.ciiva.com/14456/opa2314-14456283.pdf?src-supplier=Avnet; Supplier Part Number 1: 595-OPA314AIDBVT
U9 = NCS36000DRG: |PIR Detector Controller 14-SOIC Low Noise Amplifiers; Manufacturer: ON Semiconductor; Operating Supply Current: 50uA; Quiescent Current: 20uA; Min Supply Voltage: 3V; Max Supply Voltage: 5.75V; Output Type: Digital; Designed by: ADAK; Supplier 1: Digi-Key; Manufacturer Part Number: NCS36000DRG; RoHS: Yes; Category: Amplifiers - Op Amps, Buffer, Instrumentation; Stock 1: 21690; Pricing 1: 1=1,31000, 10=1,16700, 25=1,10760, 100=0,90990, 250=0,85052, 500=0,75162, 1000=0,59339 (USD); Case/Package: SOIC; Number of Pins: 14; Min Operating Temperature: -40°C; Max Operating Temperature: 85°C; Package Quantity: 3000; Packaging: Tape and Reel; Series: -; Input Type: DIGITAL; Length: 8.75mm; Width: 4mm; Height: 1.5mm; Radiation Hardening: No; Reach SVHC Compliant: Yes; Lead Free: Lead Free; Halogen Free: Halogen Free; RoHS Compliant: Yes; ComponentLink1URL: https://datasheet.ciiva.com/1781/ncs36000-d-1781637.pdf?src-supplier=Digi-Key; ComponentLink1Description: https://datasheet.ciiva.com/1781/ncs36000-d-1781637.pdf?src-supplier=Digi-Key; ComponentLink2URL: https://datasheet.ciiva.com/4763/ncs36000-d-89569-4763639.pdf?src-supplier=Mouser; ComponentLink2Description: https://datasheet.ciiva.com/4763/ncs36000-d-89569-4763639.pdf?src-supplier=Mouser; ComponentLink3URL: https://datasheet.ciiva.com/1781/ncs36000-d-1781638.pdf?src-supplier=Digi-Key; ComponentLink3Description: https://datasheet.ciiva.com/1781/ncs36000-d-1781638.pdf?src-supplier=Digi-Key; ComponentLink4URL: https://datasheet.ciiva.com/1781/ncs36000-d-1781639.pdf?src-supplier=Digi-Key; ComponentLink4Description: https://datasheet.ciiva.com/1781/ncs36000-d-1781639.pdf?src-supplier=Digi-Key; ComponentLink5URL: https://datasheet.ciiva.com/2965/ncs36000-d-2965212.pdf?src-supplier=Avnet; ComponentLink5Description: https://datasheet.ciiva.com/2965/ncs36000-d-2965212.pdf?src-supplier=Avnet; ComponentLink6URL: https://datasheet.ciiva.com/2966/ncs36000-d-2966525.pdf?src-supplier=Avnet; ComponentLink6Description: https://datasheet.ciiva.com/2966/ncs36000-d-2966525.pdf?src-supplier=Avnet; Supplier Part Number 1: NCS36000DRGOSCT-ND

## Nets that join several sheets
3V3DC: Power Management (8 pins), Microcontroller (26 pins)
5VDC: Power Management (9 pins), Microcontroller (BZ1.2 C32.2)
GND: Power Management (28 pins), Microcontroller (35 pins)
LED_DRIVER: Power Management (J4.3), Microcontroller (U3.21)
NetJ4_5: Power Management (J4.5), Microcontroller (U3.22)
NetR3_1: Power Management (R3.1), Microcontroller (U3.41)
NetR4_1: Power Management (R4.1), Microcontroller (U3.40)
SWCLK: Power Management (J1.3), Microcontroller (U3.37)
SWDIO: Power Management (J1.2), Microcontroller (U3.34)
TDI: Power Management (J1.4), Microcontroller (U3.38)
TEMPERATURE_ADC: Power Management (J4.4), Microcontroller (U3.19)
USB_N: Power Management (USB1.2), Microcontroller (R17.2 U5.1 U5.6)
USB_P: Power Management (USB1.3), Microcontroller (R16.2 U5.3 U5.4)